# Altium schematic sheet SCH_IP5358.SchDoc
size A4
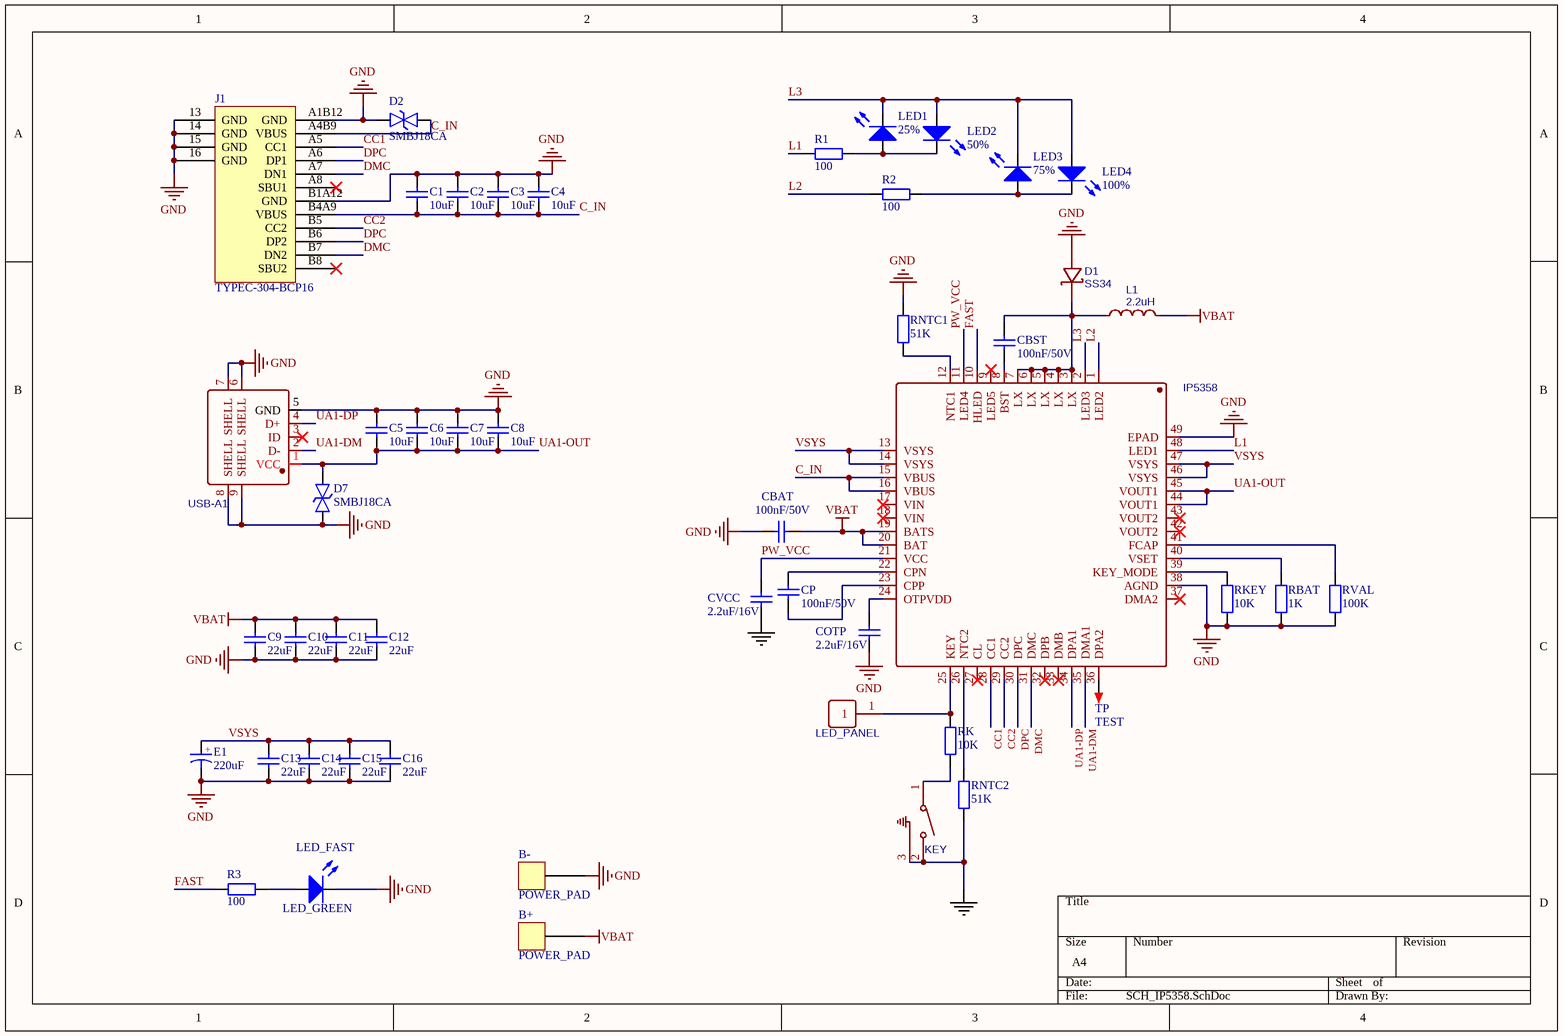
[diagram p0: SCH_IP5358.SchDoc]

## Parts
B+  POWER_PAD  [POWER_PAD]
B-  POWER_PAD  [POWER_PAD]
C1  10uF  [C0603_M]
C2  10uF  [C0603_M]
C3  10uF  [C0603_M]
C4  10uF  [C0603_M]
C5  10uF  [C0603_M]
C6  10uF  [C0603_M]
C7  10uF  [C0603_M]
C8  10uF  [C0603_M]
C9  22uF  [C0603_M]
C10  22uF  [C0603_M]
C11  22uF  [C0603_M]
C12  22uF  [C0603_M]
C13  22uF  [C1206_M]
C14  22uF  [C1206_M]
C15  22uF  [C1206_M]
C16  22uF  [C1206_M]
CBAT  100nF/50V  [C0603_M]
CBST  100nF/50V  [C0603_M]
COTP  2.2uF/16V  [C0603_M]
CP  100nF/50V  [C0603_M]
CVCC  2.2uF/16V  [C0603_M]
D1  SS34  [SS34-SMA]
D2  SMBJ18CA  [TVS]
D7  SMBJ18CA  [TVS]
E1  220uF  [CT 3.5*8*11.5 - R]
IP5358  IP5358  [IP5358]
J1  TYPEC-304-BCP16  [TYPE-C-16P]
KEY  TC-1109DE-C-G  [SWITCH]  (value not drawn)
L1  2.2uH  [2.2uH]
LED1  25%  [0603LED]
LED2  50%  [0603LED]
LED3  75%  [0603LED]
LED4  100%  [0603LED]
LED_FAST  LED_GREEN  [0603LED]
LED_PANEL  PZ254V-11-01P  [LED]  (value not drawn)
R1  100  [R0402_L]
R2  100  [R0402_L]
R3  100  [R0402_L]
RBAT  1K  [R0402_M]
RK  10K  [R0402_M]
RKEY  10K  [R0402_M]
RNTC1  51K  [R0603_M]
RNTC2  51K  [R0603_M]
RVAL  100K  [R0603_M]
TP  TEST  [TEST 1.6]
USB-A1  U234-051N-3GRA035-5  [USB-A-5P]  (value not drawn)

## Nets
GND: B-.1 C1.2 C2.2 C3.2 C4.2 C5.2 C6.2 C7.2 C8.2 C9.1 C10.1 C11.1 C12.1 C13.1 C14.1 C15.1 C16.1 CBAT.2 COTP.1 CVCC.1 D1.2(A) D2.1 D7.1 E1.2 IP5358.38(AGND) IP5358.49(EPAD) J1.13(GND) J1.14(GND) J1.15(GND) J1.16(GND) J1.A1B12(GND) J1.B1A12(GND) KEY.2 KEY.3 LED_FAST.2 RBAT.1 RKEY.1 RNTC1.2 RNTC2.1 RVAL.1 USB-A1.5(GND) USB-A1.6(SHELL) USB-A1.7(SHELL) USB-A1.8(SHELL) USB-A1.9(SHELL)
VBAT: B+.1 C9.2 C10.2 C11.2 C12.2 CBAT.1 IP5358.19(BATS) IP5358.20(BAT) L1.2
C_IN: C1.1 C2.1 C3.1 C4.1 D2.2 IP5358.15(VBUS) IP5358.16(VBUS) J1.A4B9(VBUS) J1.B4A9(VBUS)
CC1: IP5358.28(CC1) J1.A5(CC1)
CC2: IP5358.29(CC2) J1.B5(CC2)
DMC: IP5358.31(DMC) J1.A7(DN1) J1.B7(DN2)
DPC: IP5358.30(DPC) J1.A6(DP1) J1.B6(DP2)
FAST: IP5358.10(HLED) R3.1
L1: IP5358.48(LED1) R1.1
L2: IP5358.1(LED2) R2.1
L3: IP5358.2(LED3) LED1.2 LED2.1 LED3.2 LED4.1
PW_VCC: CVCC.2 IP5358.11(LED4) IP5358.21(VCC)
UA1-DM: IP5358.35(DMA1) USB-A1.2(D-)
UA1-DP: IP5358.34(DPA1) USB-A1.4(D+)
UA1-OUT: C5.1 C6.1 C7.1 C8.1 D7.2 IP5358.44(VOUT1) IP5358.45(VOUT1) USB-A1.1(VCC)
VSYS: C13.2 C14.2 C15.2 C16.2 E1.1 IP5358.13(VSYS) IP5358.14(VSYS) IP5358.46(VSYS) IP5358.47(VSYS)
NetCBST_1: CBST.1 IP5358.8(BST)
NetCBST_2: CBST.2 D1.1(C) IP5358.3(LX) IP5358.4(LX) IP5358.5(LX) IP5358.6(LX) IP5358.7(LX) L1.1
NetCOTP_2: COTP.2 IP5358.24(OTPVDD)
NetCP_1: CP.1 IP5358.22(CPN)
NetCP_2: CP.2 IP5358.23(CPP)
NetIP5358_12: IP5358.12(NTC1) RNTC1.1
NetIP5358_25: IP5358.25(KEY) LED_PANEL.1 RK.2
NetIP5358_26: IP5358.26(NTC2) RNTC2.2
NetIP5358_36: IP5358.36(DPA2) TP.1
NetIP5358_39: IP5358.39(KEY_MODE) RKEY.2
NetIP5358_40: IP5358.40(VSET) RBAT.2
NetIP5358_41: IP5358.41(FCAP) RVAL.2
NetKEY_1: KEY.1 RK.1
NetLED1_1: LED1.1 LED2.2 R1.2
NetLED3_1: LED3.1 LED4.2 R2.2
NetLED_FAST_1: LED_FAST.1 R3.2

Not connected (* = marked no-connect by the designer): IP5358 9(LED5)* 17(VIN)* 18(VIN)* 27(CL)* 32(DPB)* 33(DMB)* 37(DMA2)* 42(VOUT2)* 43(VOUT2)*; J1 A8(SBU1)* B8(SBU2)*; USB-A1 3(ID)*

## Notes on the sheet
- (in symbol CS) +

## Library data of the parts
C1-C8 CBAT CBST COTP CP CVCC = C: 10uF(106) ±10% 25V; BOM名称: 无极性贴片电容; 联系卖家，免费查找封装: 唯一出售店铺网址https://shop463601444.taobao.com
C9-C12 = C: 22uF/10V; BOM名称: 无极性贴片电容; 联系卖家，免费查找封装: 唯一出售店铺网址https://shop463601444.taobao.com
C13-C16 = C: 22uF/16V; BOM名称: 无极性贴片电容; 联系卖家，免费查找封装: 唯一出售店铺网址https://shop463601444.taobao.com
D1 = SS34_C408258: BOM_Manufacturer: SLKORMICRO Elec.; Contributor: LCSC; BOM_Supplier: LCSC; BOM_Supplier Part: C408258; BOM_Manufacturer Part: SS34; BOM_JLCPCB Part Class: Extended Part; spicePre: D; spiceSymbolName: SS34_C408258
D2 D7 = TVS: 18V
E1 = CS: 220uF/25V直插固态电容; BOM名称: 直插固态电容; 联系卖家，免费查找封装: 唯一出售店铺网址https://shop463601444.taobao.com
IP5358 = IP5358: Contributor: Qmery2020_LoveWaiterSeries; spicePre: U; spiceSymbolName: IP5358
J1 = TYPEC-304-BCP16: TYPEC-16P
KEY = TC-1109DE-C-G: BOM_Manufacturer: XKB Enterprise; Contributor: LCSC; BOM_Supplier: LCSC; BOM_Supplier Part: C400325; BOM_Manufacturer Part: TC-1109DE-C-G; BOM_JLCPCB Part Class: Extended Part; spicePre: S; spiceSymbolName: TC-1109DE-C-G
L1 = 2.2uH: BOM_Manufacturer: YJYCOIN; BOM_Manufacturer Part: YSPI0740-2R2M; nameAlias: Inductance; Contributor: LCSC; BOM_Supplier: LCSC; BOM_Supplier Part: C718393; spicePre: L; spiceSymbolName: YSPI0740-2R2M
LED1-LED4 = LED: WHITE; Published: 8-Jun-2000; LatestRevisionDate: 17-Jul-2002; LatestRevisionNote: Re-released for DXP Platform.; PackageVersion: Feb-2002; PackageReference: 3.2X1.6X1.1; Publisher: Altium Limited; PackageDescription: SM LED; 2 Flat Leads
LED_FAST = LED: GREEN; Published: 8-Jun-2000; LatestRevisionDate: 17-Jul-2002; LatestRevisionNote: Re-released for DXP Platform.; PackageVersion: Feb-2002; PackageReference: 3.2X1.6X1.1; Publisher: Altium Limited; PackageDescription: SM LED; 2 Flat Leads
LED_PANEL = PZ254V-11-01P: BOM_Manufacturer: XFCN; Contributor: LCSC; BOM_Supplier: LCSC; BOM_Supplier Part: C492400; BOM_Manufacturer Part: PZ254V-11-01P; JLCPCB Part Class: Extended Part; spicePre: H; spiceSymbolName: PZ254V-11-01P
R1-R3 RBAT RK RKEY RNTC1 RNTC2 RVAL = R: 贴片电阻; 联系卖家，免费查找封装: 唯一出售店铺网址https://shop463601444.taobao.com; BOM名称: 贴片电阻
TP = TEST: 测试点; 联系卖家，免费查找封装: 唯一出售店铺网址https://shop463601444.taobao.com; 封装库来自淘宝卖家ID：黄晶宝石: 其他店铺购入均为盗版假冒封装库，请立即申请退款; BOM名称: 测试点
USB-A1 = USB-A-5P: BOM_Manufacturer: XKB Enterprise; Contributor: LCSC; BOM_Supplier: LCSC; BOM_Supplier Part: C381138; BOM_Manufacturer Part: U234-051N-3GRA035-5; BOM_JLCPCB Part Class: Extended Part; spicePre: U; spiceSymbolName: U234-051N-3GRA035-5